# Altium project slave-12-ltc6811-1.PrjPcb (part 4 of 4)
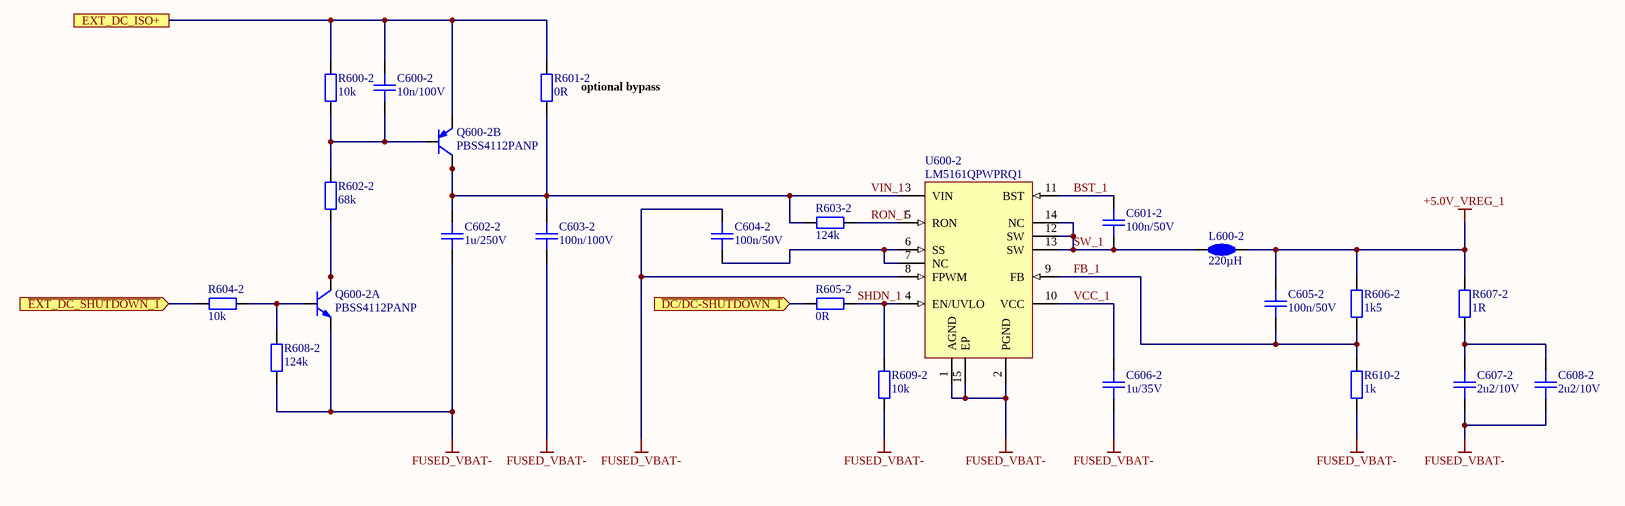
[diagram p21: secondary_dcdc_converter.SchDoc]

## Nets that join several sheets
+3.0V_VREF2_0: connectors (C401.2 C405.2 X400.17 X402.1), primary_LTC (C1402-1.2 IC1400-1.34 TP1401-1.1), prim_analog_in (9 pins)
+3.0V_VREF2_1: connectors (C402.2 C407.2 X402.2 X403.17), secondary_LTC (C1402-2.2 IC1400-2.34 TP1401-2.1), secon_analog_in (9 pins)
+5.0V_VREG_0: connectors (C400.2 C404.2 X401.9 X402.3), feedback (D1100.2), primary_LTC (12 pins), primary_DIO (13 pins), primary_EEPROM_and_T (6 pins), prim_analog_in (15 pins), primary_dcdc_converter (C605-1.2 L600-1.2 R606-1.1 R607-1.1)
+5.0V_VREG_1: connectors (C403.2 C406.2 X402.4 X404.9), feedback (D1100.1), secondary_LTC (12 pins), secondary_DIO (13 pins), secondary_EEPROM_and_T (6 pins), secon_analog_in (15 pins), secondary_dcdc_converter (C605-2.2 L600-2.2 R606-2.1 R607-2.1)
FUSED_VBAT+: cell_fuses (F300.2), primary_LTC (D1400-1.1), secondary_LTC (D1400-2.1)
FUSED_VBAT-: cell_fuses (F314.2), primary_decoupling (12 pins), secondary_decoupling (12 pins), ext_supply (6 pins), connectors (14 pins), feedback (C1100.1 R1112.2), primary_LTC (13 pins), secondary_LTC (13 pins), primary_DIO (C700-1.1 C701-1.1 U700-1.2 U700-1.8), secondary_DIO (C700-2.1 C701-2.1 U700-2.2 U700-2.8), primary_EEPROM_and_T (5 pins), secondary_EEPROM_and_T (5 pins), prim_analog_in (25 pins), secon_analog_in (25 pins), bat_connectors (16 pins), primary_dcdc_converter (14 pins), secondary_dcdc_converter (14 pins)
VBAT+: cell_fuses (F300.1 SJ300.1), bat_connectors (X200.8)
VBAT-: cell_fuses (F314.1 SJ301.2), bat_connectors (X200.1)
CELL0_FEEDBACK+: feedback (R1110.1), passive_balancing (R1534.2 R1535.2 T1510.3)
CELL1_FEEDBACK+: feedback (R1108.1), passive_balancing (R1526.2 R1527.2 T1509.3)
CELL2_FEEDBACK+: feedback (R1106.1), passive_balancing (R1522.2 R1523.2 T1507.3)
CELL3_FEEDBACK+: feedback (R1104.1), passive_balancing (R1516.2 R1517.2 T1505.3)
CELL4_FEEDBACK+: feedback (R1102.1), passive_balancing (R1510.2 R1511.2 T1503.3)
CELL5_FEEDBACK+: feedback (R1100.1), passive_balancing (R1504.2 R1505.2 T1501.3)
CELL6_FEEDBACK+: feedback (R1111.1), passive_balancing (R1532.2 R1533.2 T1511.3)
CELL7_FEEDBACK+: feedback (R1109.1), passive_balancing (R1528.2 R1529.2 T1508.3)
CELL8_FEEDBACK+: feedback (R1107.1), passive_balancing (R1520.2 R1521.2 T1506.3)
CELL9_FEEDBACK+: feedback (R1105.1), passive_balancing (R1514.2 R1515.2 T1504.3)
CELL10_FEEDBACK+: feedback (R1103.1), passive_balancing (R1508.2 R1509.2 T1502.3)
CELL11_FEEDBACK+: feedback (R1101.1), passive_balancing (R1502.2 R1503.2 T1500.3)
CELL_0+: cell_fuses (F312.1), bat_connectors (X200.2)
CELL_0-: cell_fuses (F313.1 SJ301.1), bat_connectors (X200.13)
CELL_1+: cell_fuses (F311.1), bat_connectors (X200.14)
CELL_2+: cell_fuses (F310.1), bat_connectors (X200.3)
CELL_3+: cell_fuses (F309.1), bat_connectors (X200.15)
CELL_4+: cell_fuses (F308.1), bat_connectors (X200.4)
CELL_5+: cell_fuses (F307.1), bat_connectors (X200.16)
CELL_6+: cell_fuses (F306.1), bat_connectors (X200.5)
CELL_7+: cell_fuses (F305.1), bat_connectors (X200.17)
CELL_8+: cell_fuses (F304.1), bat_connectors (X200.6)
CELL_9+: cell_fuses (F303.1), bat_connectors (X200.18)
CELL_10+: cell_fuses (F302.1), bat_connectors (X200.7)
CELL_11+: cell_fuses (F301.1 SJ300.2), bat_connectors (X200.19)
EXT_DC_IN+: ext_supply (F900.1), ext_supply_con (X1000.1 X1000.3 X1001.1 X1002.1)
EXT_DC_IN-: ext_supply (10 pins), ext_supply_con (X1000.2 X1000.4 X1001.2 X1002.2)
EXT_DC_ISO+: ext_supply (5 pins), primary_LTC (D1400-1.2 D1401-1.1 R1400-1.1), secondary_LTC (D1400-2.2 D1401-2.1 R1401-2.1), primary_dcdc_converter (C600-1.1 Q600-1.4 R600-1.2 R601-1.2), secondary_dcdc_converter (C600-2.1 Q600-2.4 R600-2.2 R601-2.2)
FUSED_CELL_0+: cell_fuses (F312.2), primary_decoupling (R1310-1.1), secondary_decoupling (R1310-2.1), feedback (U1108.2), passive_balancing (R1526.1 R1527.1 T1510.2)
FUSED_CELL_0-: cell_fuses (F313.2), primary_decoupling (R1312-1.1), secondary_decoupling (R1312-2.1), feedback (U1110.2), passive_balancing (R1534.1 R1535.1)
FUSED_CELL_1+: cell_fuses (F311.2), primary_decoupling (R1308-1.1), secondary_decoupling (R1308-2.1), feedback (U1106.2), passive_balancing (R1522.1 R1523.1 T1509.2)
FUSED_CELL_2+: cell_fuses (F310.2), primary_decoupling (R1306-1.1), secondary_decoupling (R1306-2.1), feedback (U1104.2), passive_balancing (R1516.1 R1517.1 T1507.2)
FUSED_CELL_3+: cell_fuses (F309.2), primary_decoupling (R1304-1.1), secondary_decoupling (R1304-2.1), feedback (U1102.2), passive_balancing (R1510.1 R1511.1 T1505.2)
FUSED_CELL_4+: cell_fuses (F308.2), primary_decoupling (R1302-1.1), secondary_decoupling (R1302-2.1), feedback (U1100.2), passive_balancing (R1504.1 R1505.1 T1503.2)
FUSED_CELL_5+: cell_fuses (F307.2), primary_decoupling (R1300-1.1), secondary_decoupling (R1300-2.1), feedback (U1111.2), passive_balancing (R1532.1 R1533.1 T1501.2)
FUSED_CELL_6+: cell_fuses (F306.2), primary_decoupling (R1311-1.1), secondary_decoupling (R1311-2.1), feedback (U1109.2), passive_balancing (R1528.1 R1529.1 T1511.2)
FUSED_CELL_7+: cell_fuses (F305.2), primary_decoupling (R1309-1.1), secondary_decoupling (R1309-2.1), feedback (U1107.2), passive_balancing (R1520.1 R1521.1 T1508.2)
FUSED_CELL_8+: cell_fuses (F304.2), primary_decoupling (R1307-1.1), secondary_decoupling (R1307-2.1), feedback (U1105.2), passive_balancing (R1514.1 R1515.1 T1506.2)
FUSED_CELL_9+: cell_fuses (F303.2), primary_decoupling (R1305-1.1), secondary_decoupling (R1305-2.1), feedback (U1103.2), passive_balancing (R1508.1 R1509.1 T1504.2)
FUSED_CELL_10+: cell_fuses (F302.2), primary_decoupling (R1303-1.1), secondary_decoupling (R1303-2.1), feedback (U1101.2), passive_balancing (R1502.1 R1503.1 T1502.2)
FUSED_CELL_11+: cell_fuses (F301.2), primary_decoupling (R1301-1.1), secondary_decoupling (R1301-2.1), passive_balancing (T1500.2)
GLOBAL-BALANCING-FEEDBACK: feedback (14 pins), primary_LTC (R1413-1.1), secondary_LTC (R1413-2.1)
LTC-Drive_0: primary_LTC (IC1400-1.38), primary_dcdc_converter (R604-1.1 R605-1.2)
LTC-Drive_1: secondary_LTC (IC1400-2.38), secondary_dcdc_converter (R604-2.1 R605-2.2)
PRIMARY-ANALOG-IN_0: connectors (X400.1), prim_analog_in (IC101-1.4)
PRIMARY-ANALOG-IN_1: connectors (X400.2), prim_analog_in (IC101-1.5)
PRIMARY-ANALOG-IN_2: connectors (X400.3), prim_analog_in (IC101-1.6)
PRIMARY-ANALOG-IN_3: connectors (X400.4), prim_analog_in (IC101-1.7)
PRIMARY-ANALOG-IN_4: connectors (X400.5), prim_analog_in (IC101-1.12)
PRIMARY-ANALOG-IN_5: connectors (X400.6), prim_analog_in (IC101-1.11)
PRIMARY-ANALOG-IN_6: connectors (X400.7), prim_analog_in (IC101-1.10)
PRIMARY-ANALOG-IN_7: connectors (X400.8), prim_analog_in (IC101-1.9)
PRIMARY-ANALOG-IN_8: connectors (X400.9), prim_analog_in (IC102-1.4)
PRIMARY-ANALOG-IN_9: connectors (X400.10), prim_analog_in (IC102-1.5)
PRIMARY-ANALOG-IN_10: connectors (X400.11), prim_analog_in (IC102-1.6)
PRIMARY-ANALOG-IN_11: connectors (X400.12), prim_analog_in (IC102-1.7)
PRIMARY-ANALOG-IN_12: connectors (X400.13), prim_analog_in (IC102-1.12)
PRIMARY-ANALOG-IN_13: connectors (X400.14), prim_analog_in (IC102-1.11)
PRIMARY-ANALOG-IN_14: connectors (X400.15), prim_analog_in (IC102-1.10)
PRIMARY-ANALOG-IN_15: connectors (X400.16), prim_analog_in (IC102-1.9)
PRIMARY-C0: primary_decoupling (C1322-1.2 R1312-1.2 Z1310-1.2), primary_LTC (IC1400-1.26)
PRIMARY-C1: primary_decoupling (6 pins), primary_LTC (IC1400-1.24)
PRIMARY-C2: primary_decoupling (6 pins), primary_LTC (IC1400-1.22)
PRIMARY-C3: primary_decoupling (6 pins), primary_LTC (IC1400-1.20)
PRIMARY-C4: primary_decoupling (6 pins), primary_LTC (IC1400-1.18)
PRIMARY-C5: primary_decoupling (6 pins), primary_LTC (IC1400-1.16)
PRIMARY-C6: primary_decoupling (6 pins), primary_LTC (IC1400-1.14)
PRIMARY-C7: primary_decoupling (6 pins), primary_LTC (IC1400-1.12)
PRIMARY-C8: primary_decoupling (6 pins), primary_LTC (IC1400-1.10)
PRIMARY-C9: primary_decoupling (6 pins), primary_LTC (IC1400-1.8)
PRIMARY-C10: primary_decoupling (6 pins), primary_LTC (IC1400-1.6)
PRIMARY-C11: primary_decoupling (6 pins), primary_LTC (IC1400-1.4)
PRIMARY-C12: primary_decoupling (C1301-1.1 C1303-1.1 R1301-1.2 Z1301-1.1), primary_LTC (IC1400-1.2)
PRIMARY-DIGITAL-IO_0: connectors (X401.1), primary_DIO (R700-1.1 U700-1.4)
PRIMARY-DIGITAL-IO_1: connectors (X401.2), primary_DIO (R701-1.1 U700-1.5)
PRIMARY-DIGITAL-IO_2: connectors (X401.3), primary_DIO (R702-1.1 U700-1.6)
PRIMARY-DIGITAL-IO_3: connectors (X401.4), primary_DIO (R703-1.1 U700-1.7)
PRIMARY-DIGITAL-IO_4: connectors (X401.5), primary_DIO (R704-1.1 U700-1.9)
PRIMARY-DIGITAL-IO_5: connectors (X401.6), primary_DIO (R705-1.1 U700-1.10)
PRIMARY-DIGITAL-IO_6: connectors (X401.7), primary_DIO (R706-1.1 U700-1.11)
PRIMARY-DIGITAL-IO_7: connectors (X401.8), primary_DIO (R707-1.1 U700-1.12)
PRIMARY-GPIO1-OPT: connectors (X402.5), primary_LTC (R1404-1.1 R1405-1.1)
PRIMARY-GPIO2-OPT: connectors (X402.7), primary_LTC (R1408-1.1 R1409-1.1)
PRIMARY-GPIO3-OPT: connectors (X402.9), primary_LTC (R1411-1.1 R1412-1.1)
PRIMARY-GPIO4-OPT: connectors (X402.11), primary_LTC (R1414-1.1)
PRIMARY-GPIO5-OPT: connectors (X402.13), primary_LTC (R1418-1.1)
PRIMARY-IN+: primary_LTC (TP1407-1.1 TR1400-1.4), daisy_chain_connectors (X500.1)
PRIMARY-IN-: primary_LTC (TR1400-1.6), daisy_chain_connectors (X500.2)
PRIMARY-MUX-DATA_TEMP: primary_LTC (R1406-1.1), prim_analog_in (C111-1.2 R116-1.2)
PRIMARY-MUX-DATA_USER: primary_LTC (R1410-1.1), prim_analog_in (C115-1.2 R118-1.2)
PRIMARY-OUT+: primary_LTC (TP1406-1.1 TR1400-1.1), daisy_chain_connectors (X501.1)
PRIMARY-OUT-: primary_LTC (TR1400-1.3), daisy_chain_connectors (X501.2)
PRIMARY-SCL_0: primary_LTC (R1416-1.1 R1420-1.1 TP1405-1.1), primary_DIO (U700-1.14), primary_EEPROM_and_T (IC800-1.6 IC801-1.4), prim_analog_in (IC100-1.1 IC101-1.1 IC102-1.1)
PRIMARY-SDA_0: primary_LTC (R1415-1.1 R1417-1.1 TP1404-1.1), primary_DIO (U700-1.15), primary_EEPROM_and_T (IC800-1.5 IC801-1.5), prim_analog_in (IC100-1.3 IC101-1.3 IC102-1.3)
PRIMARY-T-SENSOR_0: prim_analog_in (R107-1.1 R108-1.2), bat_connectors (X201.1)
PRIMARY-T-SENSOR_1: prim_analog_in (R103-1.1 R109-1.2), bat_connectors (X201.2)
PRIMARY-T-SENSOR_2: prim_analog_in (R106-1.1 R110-1.2), bat_connectors (X201.3)
PRIMARY-T-SENSOR_3: prim_analog_in (R102-1.1 R111-1.2), bat_connectors (X201.4)
PRIMARY-T-SENSOR_4: prim_analog_in (R105-1.1 R112-1.2), bat_connectors (X201.5)
PRIMARY-T-SENSOR_5: prim_analog_in (R101-1.1 R113-1.2), bat_connectors (X201.6)
PRIMARY-T-SENSOR_6: prim_analog_in (R104-1.1 R114-1.2), bat_connectors (X201.7)
PRIMARY-T-SENSOR_7: prim_analog_in (R100-1.1 R115-1.2), bat_connectors (X201.8)
PRIMARY-TEMP-ALERT: connectors (X402.17), primary_EEPROM_and_T (IC801-1.3 R801-1.1)
PRIMARY-WDT: connectors (X402.15), primary_LTC (IC1400-1.39 R1401-1.1)
S1: passive_balancing (R1530.2), primary_LTC (IC1400-1.25)
S2: passive_balancing (R1525.2), primary_LTC (IC1400-1.23)
S3: passive_balancing (R1519.2), primary_LTC (IC1400-1.21)
S4: passive_balancing (R1513.2), primary_LTC (IC1400-1.19)
S5: passive_balancing (R1507.2), primary_LTC (IC1400-1.17)
S6: passive_balancing (R1501.2), primary_LTC (IC1400-1.15)
S7: passive_balancing (R1531.2), primary_LTC (IC1400-1.13)
S8: passive_balancing (R1524.2), primary_LTC (IC1400-1.11)
S9: passive_balancing (R1518.2), primary_LTC (IC1400-1.9)
S10: passive_balancing (R1512.2), primary_LTC (IC1400-1.7)
S11: passive_balancing (R1506.2), primary_LTC (IC1400-1.5)
S12: passive_balancing (R1500.2), primary_LTC (IC1400-1.3)
SECONDARY-ANALOG-IN_0: connectors (X403.1), secon_analog_in (IC101-2.4)
SECONDARY-ANALOG-IN_1: connectors (X403.2), secon_analog_in (IC101-2.5)
SECONDARY-ANALOG-IN_2: connectors (X403.3), secon_analog_in (IC101-2.6)
SECONDARY-ANALOG-IN_3: connectors (X403.4), secon_analog_in (IC101-2.7)
SECONDARY-ANALOG-IN_4: connectors (X403.5), secon_analog_in (IC101-2.12)
SECONDARY-ANALOG-IN_5: connectors (X403.6), secon_analog_in (IC101-2.11)
SECONDARY-ANALOG-IN_6: connectors (X403.7), secon_analog_in (IC101-2.10)
SECONDARY-ANALOG-IN_7: connectors (X403.8), secon_analog_in (IC101-2.9)
SECONDARY-ANALOG-IN_8: connectors (X403.9), secon_analog_in (IC102-2.4)
SECONDARY-ANALOG-IN_9: connectors (X403.10), secon_analog_in (IC102-2.5)
SECONDARY-ANALOG-IN_10: connectors (X403.11), secon_analog_in (IC102-2.6)
SECONDARY-ANALOG-IN_11: connectors (X403.12), secon_analog_in (IC102-2.7)
SECONDARY-ANALOG-IN_12: connectors (X403.13), secon_analog_in (IC102-2.12)
SECONDARY-ANALOG-IN_13: connectors (X403.14), secon_analog_in (IC102-2.11)
SECONDARY-ANALOG-IN_14: connectors (X403.15), secon_analog_in (IC102-2.10)
SECONDARY-ANALOG-IN_15: connectors (X403.16), secon_analog_in (IC102-2.9)
SECONDARY-C0: secondary_decoupling (C1322-2.2 R1312-2.2 Z1310-2.2), secondary_LTC (IC1400-2.26)
SECONDARY-C1: secondary_decoupling (6 pins), secondary_LTC (IC1400-2.24)
SECONDARY-C2: secondary_decoupling (6 pins), secondary_LTC (IC1400-2.22)
SECONDARY-C3: secondary_decoupling (6 pins), secondary_LTC (IC1400-2.20)
SECONDARY-C4: secondary_decoupling (6 pins), secondary_LTC (IC1400-2.18)
SECONDARY-C5: secondary_decoupling (6 pins), secondary_LTC (IC1400-2.16)
SECONDARY-C6: secondary_decoupling (6 pins), secondary_LTC (IC1400-2.14)
SECONDARY-C7: secondary_decoupling (6 pins), secondary_LTC (IC1400-2.12)
SECONDARY-C8: secondary_decoupling (6 pins), secondary_LTC (IC1400-2.10)
SECONDARY-C9: secondary_decoupling (6 pins), secondary_LTC (IC1400-2.8)
SECONDARY-C10: secondary_decoupling (6 pins), secondary_LTC (IC1400-2.6)
SECONDARY-C11: secondary_decoupling (6 pins), secondary_LTC (IC1400-2.4)
SECONDARY-C12: secondary_decoupling (C1301-2.1 C1303-2.1 R1301-2.2 Z1301-2.1), secondary_LTC (IC1400-2.2)
SECONDARY-DIGITAL-IO_0: connectors (X404.1), secondary_DIO (R700-2.1 U700-2.4)
SECONDARY-DIGITAL-IO_1: connectors (X404.2), secondary_DIO (R701-2.1 U700-2.5)
SECONDARY-DIGITAL-IO_2: connectors (X404.3), secondary_DIO (R702-2.1 U700-2.6)
SECONDARY-DIGITAL-IO_3: connectors (X404.4), secondary_DIO (R703-2.1 U700-2.7)
SECONDARY-DIGITAL-IO_4: connectors (X404.5), secondary_DIO (R704-2.1 U700-2.9)
SECONDARY-DIGITAL-IO_5: connectors (X404.6), secondary_DIO (R705-2.1 U700-2.10)
SECONDARY-DIGITAL-IO_6: connectors (X404.7), secondary_DIO (R706-2.1 U700-2.11)
SECONDARY-DIGITAL-IO_7: connectors (X404.8), secondary_DIO (R707-2.1 U700-2.12)
SECONDARY-GPIO1-OPT: connectors (X402.6), secondary_LTC (R1404-2.1 R1405-2.1)
SECONDARY-GPIO2-OPT: connectors (X402.8), secondary_LTC (R1408-2.1 R1409-2.1)
SECONDARY-GPIO3-OPT: connectors (X402.10), secondary_LTC (R1411-2.1 R1412-2.1)
SECONDARY-GPIO4-OPT: connectors (X402.12), secondary_LTC (R1414-2.1)
SECONDARY-GPIO5-OPT: connectors (X402.14), secondary_LTC (R1418-2.1)
SECONDARY-IN+: secondary_LTC (TP1407-2.1 TR1400-2.4), daisy_chain_connectors (X502.1)
SECONDARY-IN-: secondary_LTC (TR1400-2.6), daisy_chain_connectors (X502.2)
SECONDARY-MUX-DATA_TEMP: secondary_LTC (R1407-2.1), secon_analog_in (C111-2.2 R116-2.2)
SECONDARY-MUX-DATA_USER: secondary_LTC (R1410-2.1), secon_analog_in (C115-2.2 R118-2.2)
SECONDARY-OUT+: secondary_LTC (TP1406-2.1 TR1400-2.1), daisy_chain_connectors (X503.1)
SECONDARY-OUT-: secondary_LTC (TR1400-2.3), daisy_chain_connectors (X503.2)
SECONDARY-SCL_1: secondary_LTC (R1416-2.1 R1419-2.1 TP1405-2.1), secondary_DIO (U700-2.14), secondary_EEPROM_and_T (IC800-2.6 IC801-2.4), secon_analog_in (IC100-2.1 IC101-2.1 IC102-2.1)
SECONDARY-SDA_1: secondary_LTC (R1415-2.1 R1417-2.1 TP1404-2.1), secondary_DIO (U700-2.15), secondary_EEPROM_and_T (IC800-2.5 IC801-2.5), secon_analog_in (IC100-2.3 IC101-2.3 IC102-2.3)
SECONDARY-T-SENSOR_0: secon_analog_in (R107-2.1 R108-2.2), bat_connectors (X202.1)
SECONDARY-T-SENSOR_1: secon_analog_in (R103-2.1 R109-2.2), bat_connectors (X202.2)
SECONDARY-T-SENSOR_2: secon_analog_in (R106-2.1 R110-2.2), bat_connectors (X202.3)
SECONDARY-T-SENSOR_3: secon_analog_in (R102-2.1 R111-2.2), bat_connectors (X202.4)
SECONDARY-T-SENSOR_4: secon_analog_in (R105-2.1 R112-2.2), bat_connectors (X202.5)
SECONDARY-T-SENSOR_5: secon_analog_in (R101-2.1 R113-2.2), bat_connectors (X202.6)
SECONDARY-T-SENSOR_6: secon_analog_in (R104-2.1 R114-2.2), bat_connectors (X202.7)
SECONDARY-T-SENSOR_7: secon_analog_in (R100-2.1 R115-2.2), bat_connectors (X202.8)
SECONDARY-TEMP-ALERT: connectors (X402.18), secondary_EEPROM_and_T (IC801-2.3 R801-2.1)
SECONDARY-WDT: connectors (X402.16), secondary_LTC (IC1400-2.39 R1400-2.1)

## Assembly variants
default: not fitted C902 C903 C906 C907 C910 C911 C914 C915 C918 C919 C922 C923 C1402 C1403 C1406 C1407 C1410 C1411 C1414 C1415 C1418 C1419 C1422 C1423 R503 R609 R1100 R1205 R1206 R1209 R1211 R1213 R1217 R1310 R1311 R1510 R1600 R1703 R1706 R1709 R1711 R1713 R1717 R1817 R1819 SJ200 SJ201 X500
automotive: not fitted C902 C903 C906 C907 C910 C911 C914 C915 C918 C919 C922 C923 C1402 C1403 C1406 C1407 C1410 C1411 C1414 C1415 C1418 C1419 C1422 C1423 R503 R609 R1100 R1205 R1206 R1209 R1211 R1213 R1217 R1310 R1311 R1510 R1600 R1703 R1706 R1709 R1711 R1713 R1717 R1817 R1819 SJ200 SJ201 X500; alternate parts U700 -> TLX9291A, U701 -> TLX9291A, U702 -> TLX9291A, U703 -> TLX9291A, U704 -> TLX9291A, U705 -> TLX9291A, U706 -> TLX9291A, U707 -> TLX9291A, U708 -> TLX9291A, U709 -> TLX9291A, U710 -> TLX9291A, U711 -> TLX9291A